# EAGLE board smartstand-usb-dac-amplifier-rev-a (EAGLE 7.3.0), part 1 of 2
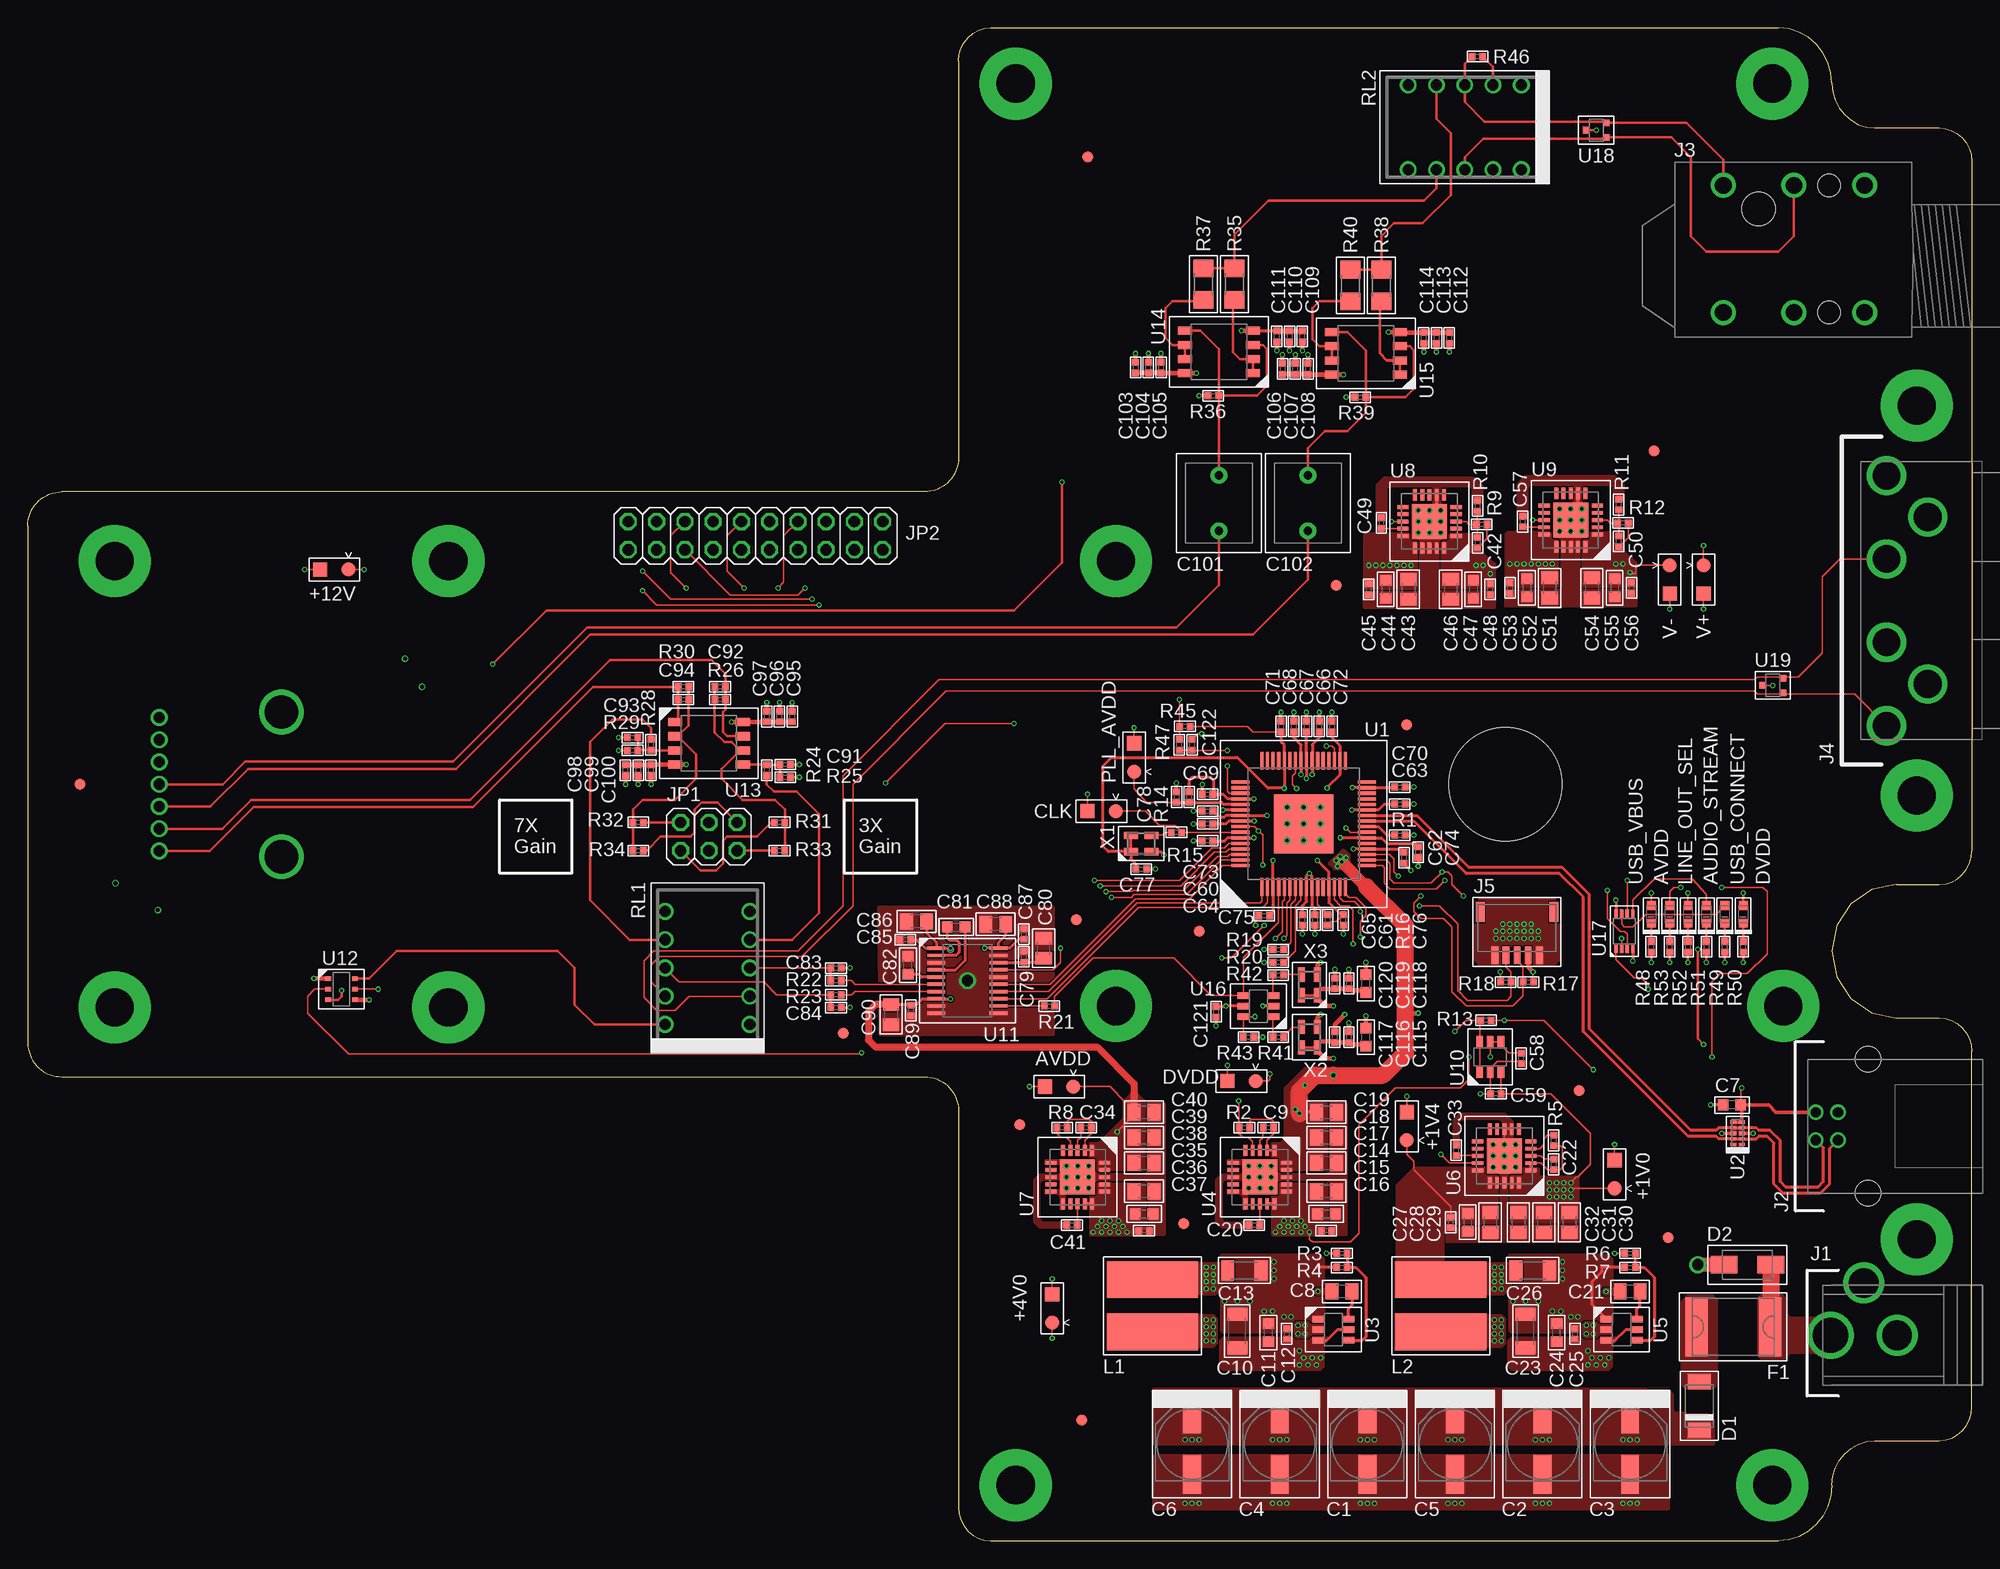
[diagram p13: board, top side]
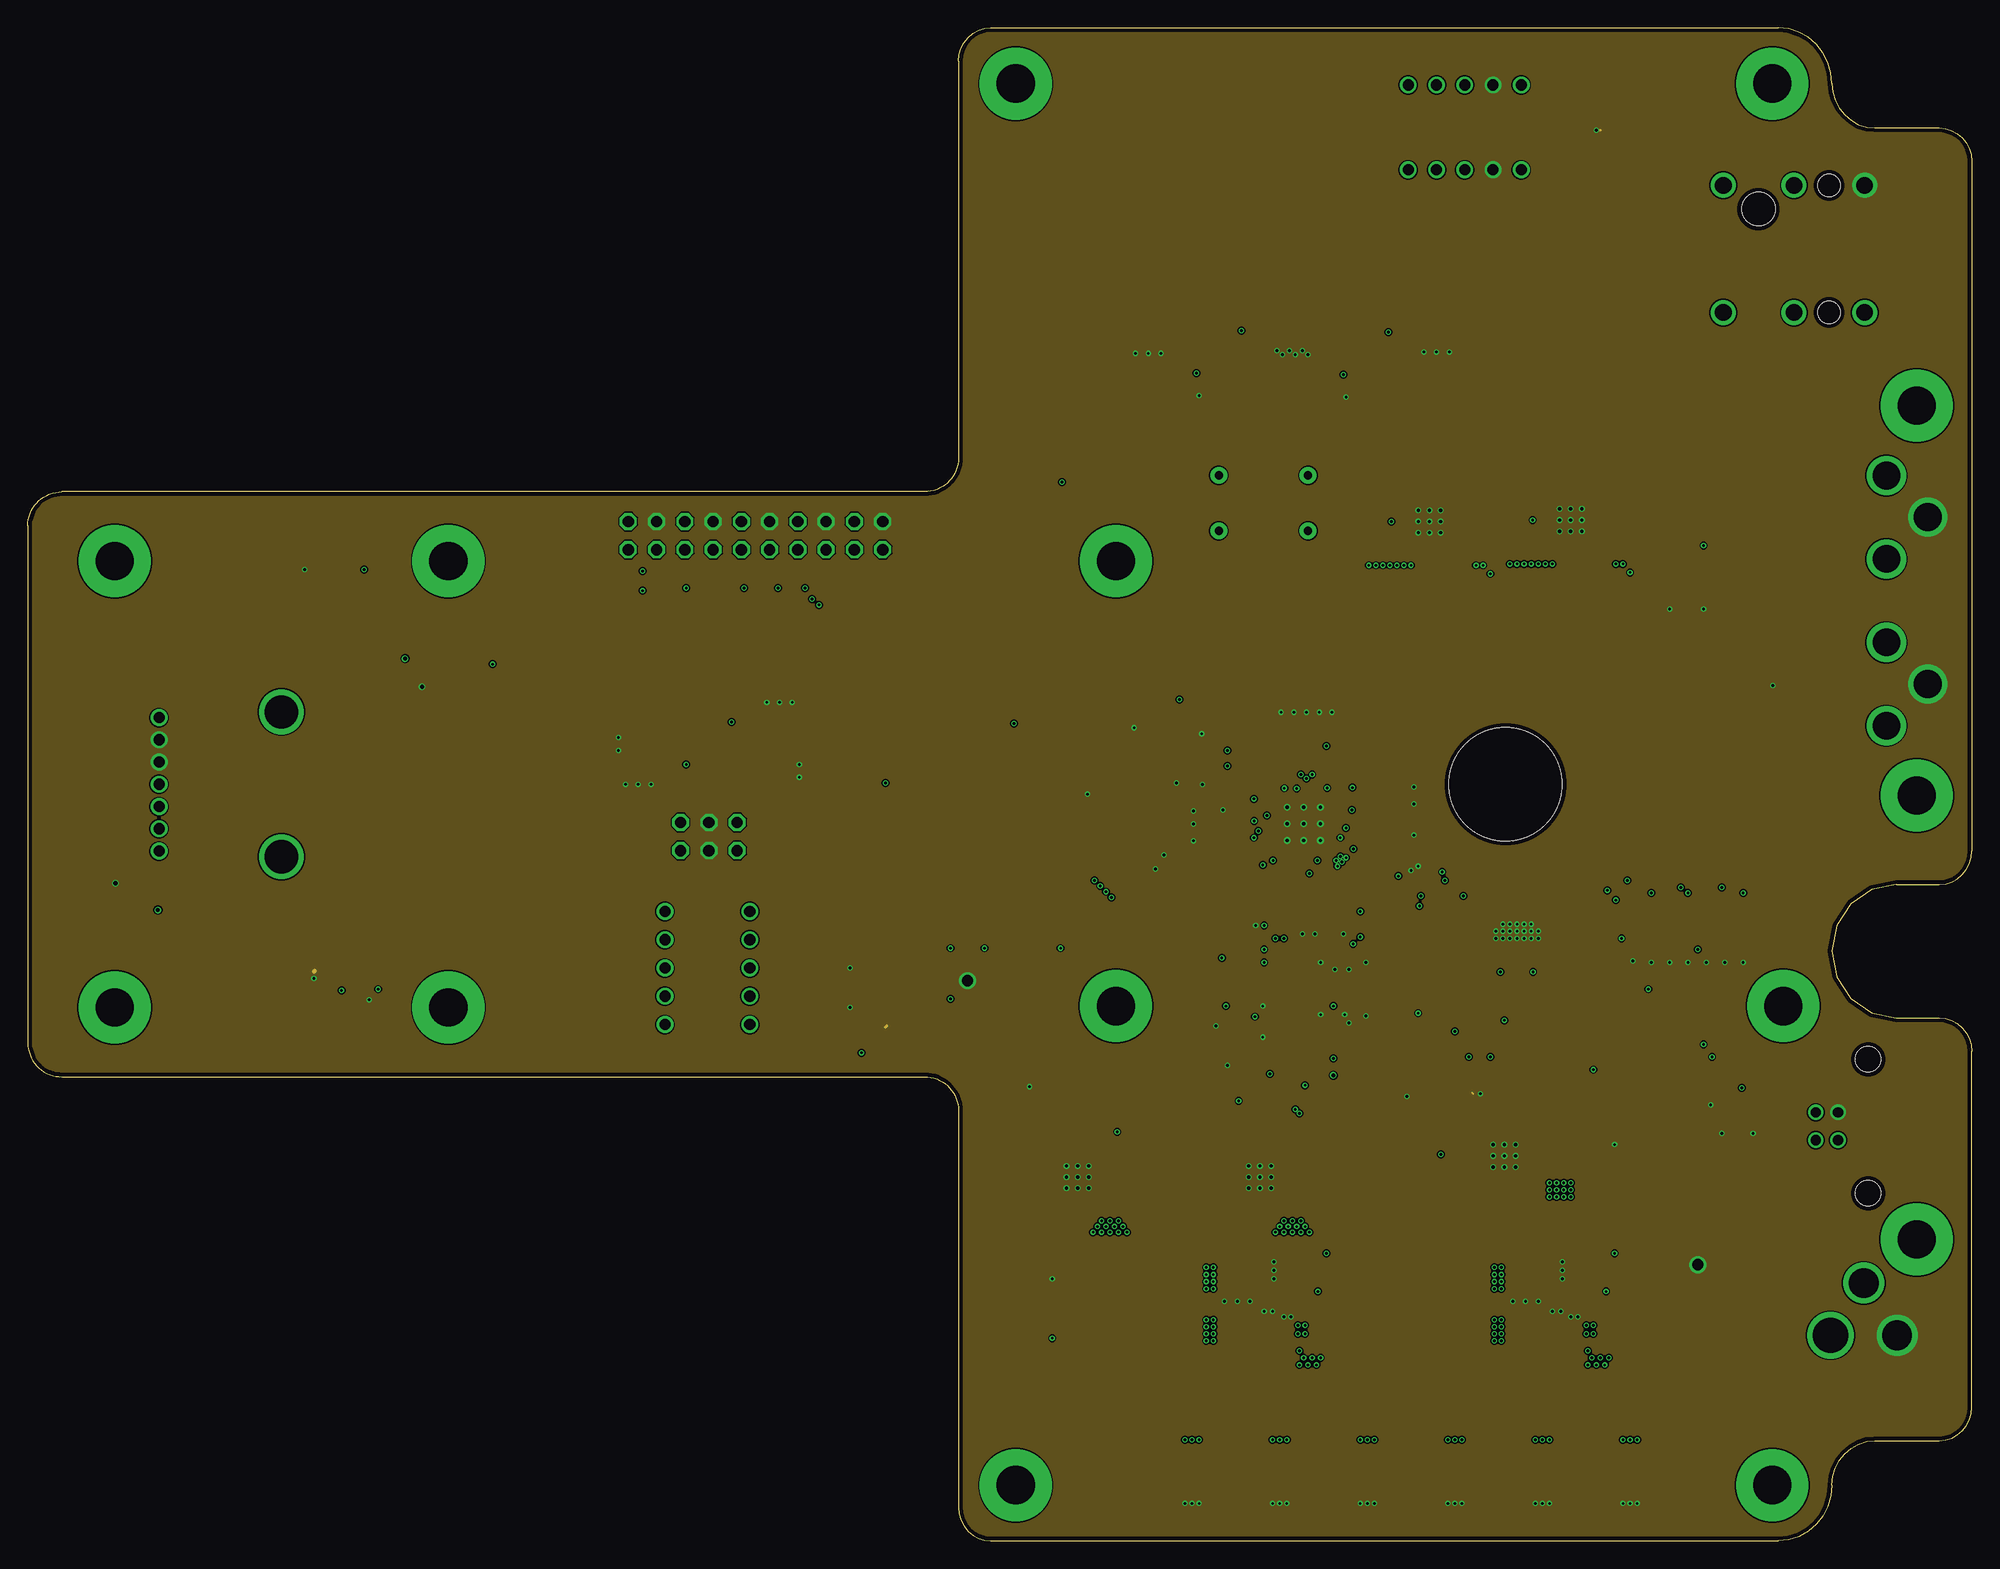
[diagram p14: board, inner layer Route2]
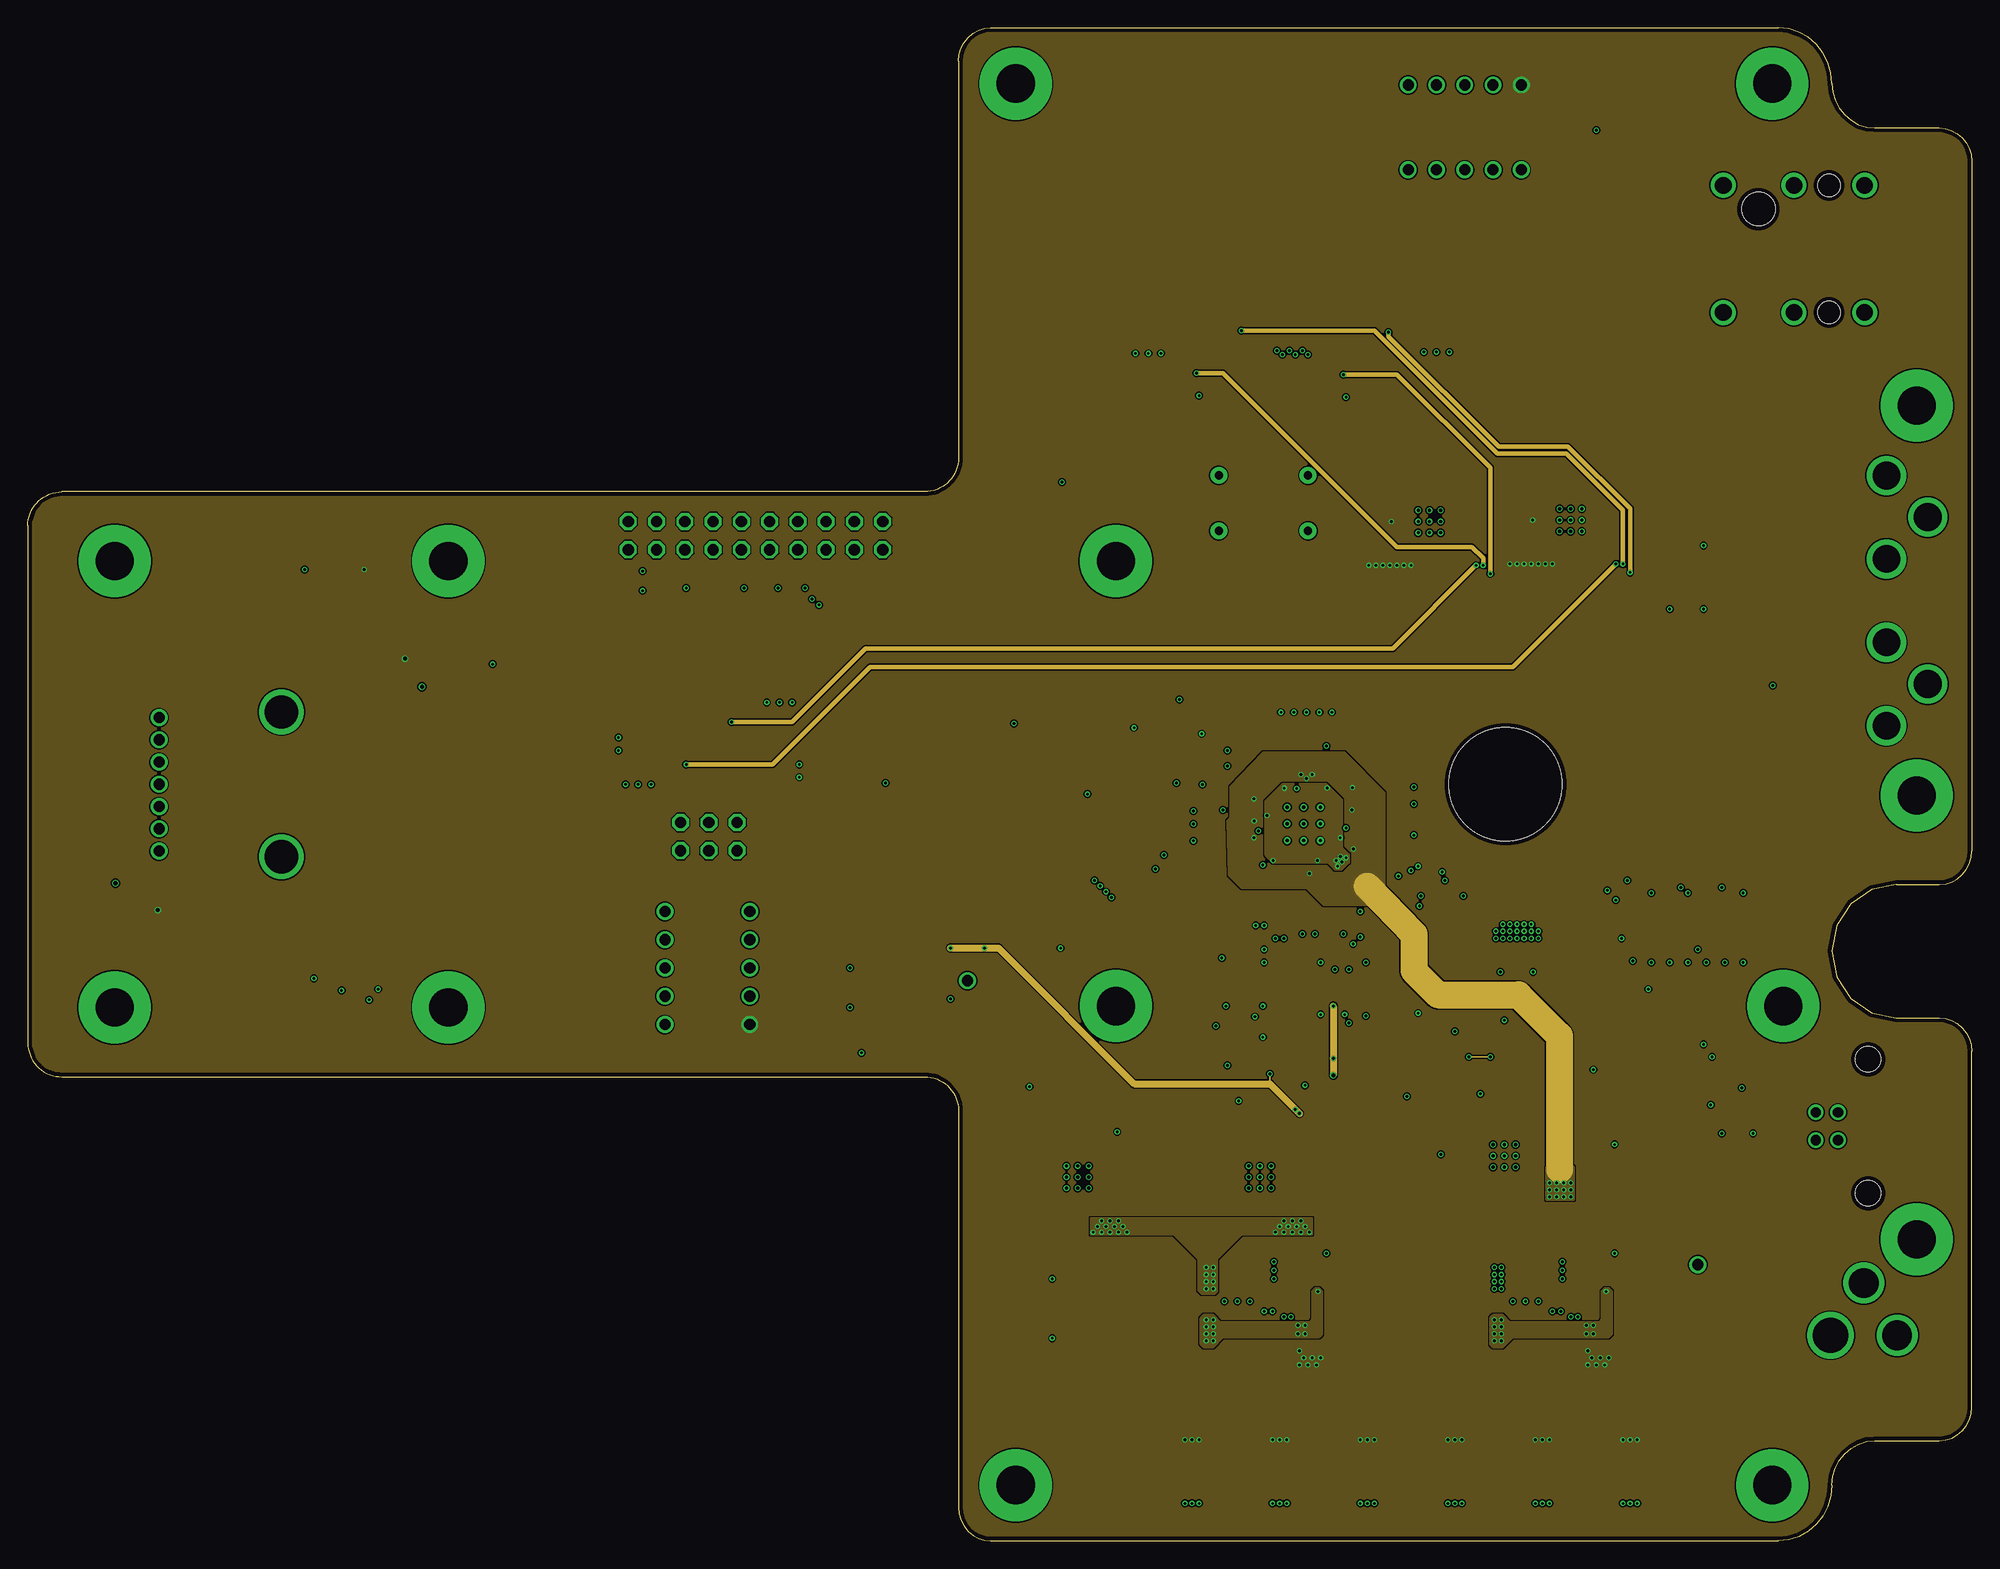
[diagram p15: board, inner layer Route15]
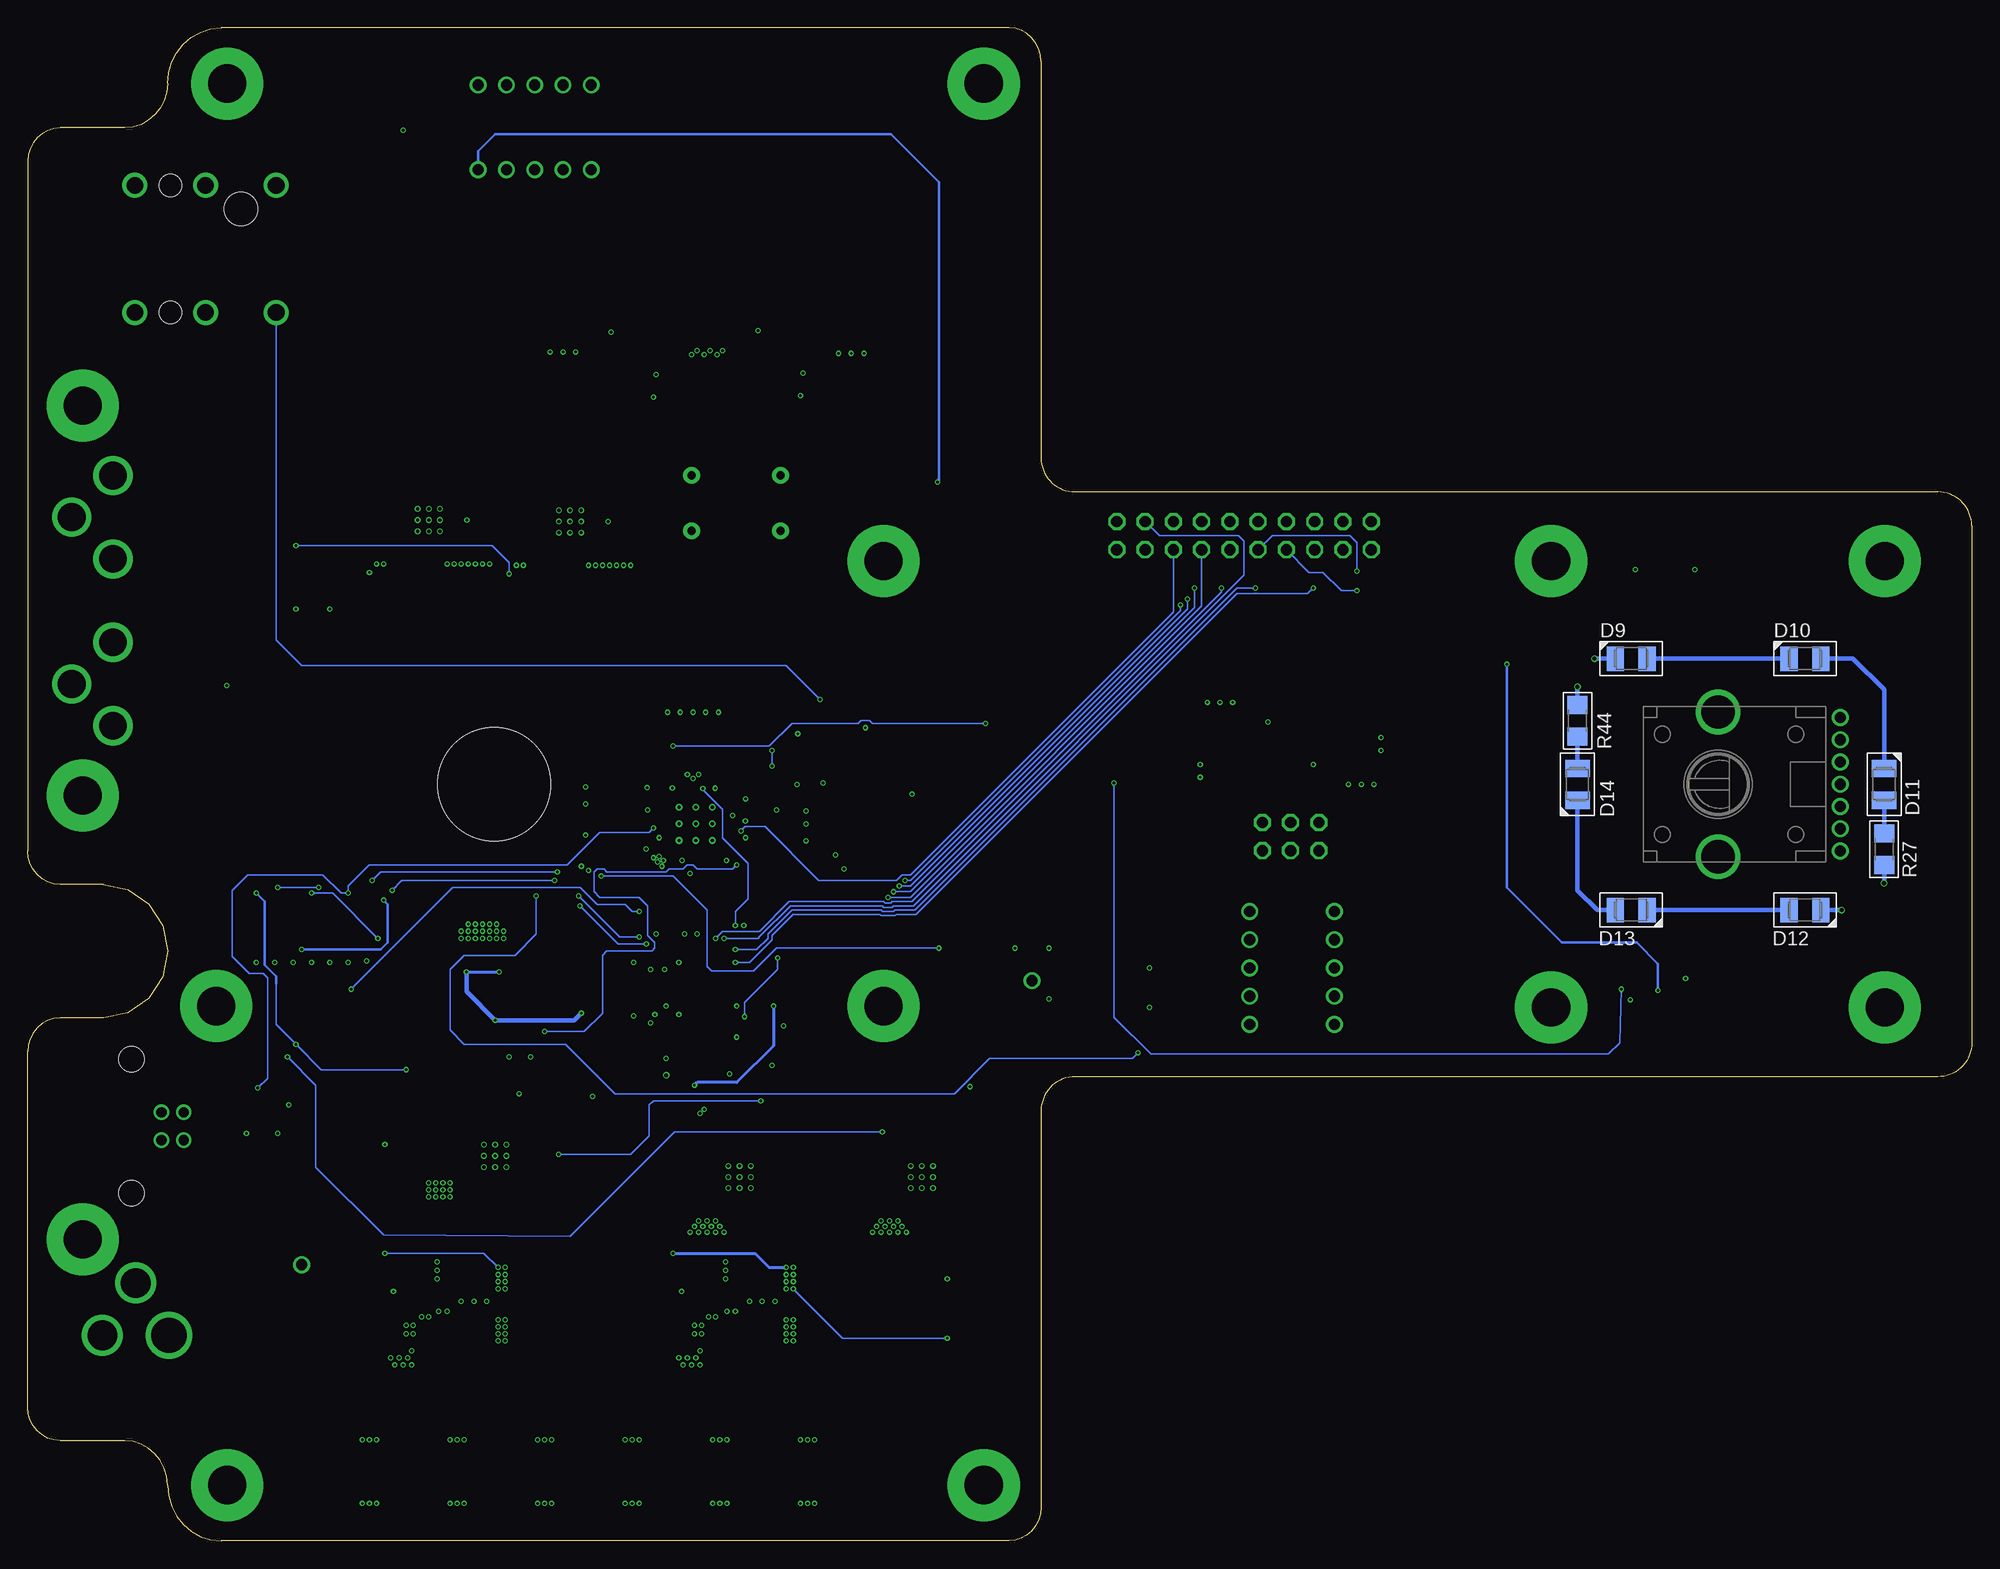
[diagram p16: board, bottom side, seen from below]

Size 174.72 x 136 mm. Coordinates in mm from the lower left corner, seen from the top.
Outline: 171.82,9 172.39,9.06 172.93,9.23 173.43,9.51 173.87,9.88 174.23,10.33 174.5,10.85 174.66,11.41 174.72,12 174.72,44 174.66,44.59 174.5,45.15 174.23,45.67 173.87,46.12 173.43,46.49 172.93,46.77 172.39,46.94 171.82,47 167.96,47 165.74,47.46 163.86,48.76 162.6,50.7 162.16,53 162.6,55.3 163.86,57.24 165.74,58.54 167.96,59 171.82,59 172.39,59.06 172.93,59.23 173.43,59.51 173.87,59.88 174.23,60.33 174.5,60.85 174.66,61.41 174.72,62 174.72,124 174.66,124.59 174.5,125.15 174.23,125.67 173.87,126.12 173.43,126.49 172.93,126.77 172.39,126.94 171.82,127 166.03,127 165.27,127.08 164.55,127.3 163.88,127.67 163.3,128.17 162.81,128.78 162.46,129.47 162.24,130.22 162.16,131 162.07,131.97 161.8,132.91 161.35,133.78 160.75,134.54 160.02,135.16 159.18,135.62 158.28,135.9 157.33,136 86.54,136 85.98,135.94 85.44,135.77 84.93,135.49 84.49,135.12 84.13,134.67 83.87,134.15 83.7,133.58 83.65,133 83.65,97.34 arc-90 80.6,94.29 3.05,94.29 arc90 0,91.24 0,44.76 arc90 3.05,41.71 80.6,41.71 arc-90 83.65,38.66 83.65,3 83.7,2.42 83.87,1.85 84.13,1.33 84.49,0.88 84.93,0.51 85.44,0.23 85.98,0.06 86.54,0 157.33,0 158.28,0.1 159.18,0.38 160.02,0.84 160.75,1.46 161.35,2.22 161.8,3.09 162.07,4.02 162.16,5 162.24,5.78 162.46,6.53 162.81,7.22 163.3,7.83 163.88,8.33 164.55,8.7 165.27,8.92 166.03,9 171.82,9
Copper layers (1*2*15*16): Top 0.035559375mm / dielectric 0.17018125mm / Route2 0.01778125mm / dielectric 47mil / Route15 0.01778125mm / dielectric 0.17018125mm / Bottom 0.035559375mm
Design rules "OSHPark-4Layer": minimum track width 5mil, minimum drill 10mil, track to track 5mil, track to pad 5mil, pad to pad 5mil, via to via 5mil, smd to smd 5mil, copper to edge 15mil, drill to drill 6mil, minimum pad ring 4mil, minimum via ring 4mil, stop-mask expansion 2.5mil, vias tented up to drill 11mil, thermal gap 10mil
Net classes: 0 default: width 0.152 mm, drill 0.254 mm; 1 USB: width 0.279 mm, drill 0.254 mm
Holes 10.16 mm at 132.81,68

## Footprints (pad centres in the part's own frame; a part is rotated, then mirrored left to right if it is on the bottom)
CHEMICON_F55 = smd 3.5 x 1.6: + -2.7,0; - 2.7,0
C0603 = smd 0.95 x 1: 1 -0.8,0; 2 0.8,0
C0805 = smd 1.15 x 1.45: 1 -0.9,0; 2 0.9,0
C0402 = smd 0.59 x 0.64: 1 -0.48,0; 2 0.48,0
C1206 = smd 1.15 x 1.8: 1 -1.5,0; 2 1.5,0
KEMET-5MM-6.0-7.2 = drill 0.75 pad 1.5: P$1 -2.5,0; P$2 2.5,0
SOD128 = smd 1.4 x 2.1: A 2.2,0; C -2.2,0
SMA = smd 2.4 x 1.55: A 2.1,0; C -2.1,0
DIALIGHT-0603 = smd 0.8 x 0.8: 1 -0.8,0; 2 0.8,0
PLCC-2 = smd 1.55 x 2.2: ANODE -1.425,0; CATHODE 1.425,0
2920L = smd 2 x 5.3: P$1 -3.3,0; P$2 3.3,0
PJ-002A = drill 3.175: 1 -3,0 | drill 2.667: 2 3,0; 3 0,4.7
292304 = drill 0.92: P$1 1.25,9.6; P$2 -1.25,9.6; P$3 -1.25,7.6; P$4 1.25,7.6 | hole 2.3: -6.02,4.89; 6.02,4.89
NRJ6HH = drill 1.5: R 0,7.23; RN 0,-4.2; S 6.35,7.23; SN 6.35,-4.2; T -6.35,7.23; TN -6.35,-4.2 | hole 2: 3.15,7.23; 3.15,-4.2 | hole 3: -3.2,5.1
PJRAN2X1U = drill 2.5: L_SHUNT 11.25,3.7; L_SLEEVE 7.5,0; L_TIP 3.75,3.7; R_SHUNT -3.75,3.7; R_SLEEVE -7.5,0; R_TIP -11.25,3.7
T1M-SINGLE-5POS = smd 0.6 x 1.55: 1 2,-2.781; 2 1,-2.781; 3 0,-2.781; 4 -1,-2.781; 5 -2,-2.781 | smd 0.8 x 1.8: G1 3.3,1.094; G2 -3.3,1.094
2X03 = drill 1.016 octagon: 1 -2.54,-1.27; 2 -2.54,1.27; 3 0,-1.27; 4 0,1.27; 5 2.54,-1.27; 6 2.54,1.27
2X10 = drill 1.016 octagon: 1 -11.43,-1.27; 2 -11.43,1.27; 3 -8.89,-1.27; 4 -8.89,1.27; 5 -6.35,-1.27; 6 -6.35,1.27; 7 -3.81,-1.27; 8 -3.81,1.27; 9 -1.27,-1.27; 10 -1.27,1.27; 11 1.27,-1.27; 12 1.27,1.27; 13 3.81,-1.27; 14 3.81,1.27; 15 6.35,-1.27; 16 6.35,1.27; 17 8.89,-1.27; 18 8.89,1.27; 19 11.43,-1.27; 20 11.43,1.27
TDK-VLP8040 = smd 3.3 x 8.2: P$1 -2.35,0; P$2 2.35,0
R0402 = smd 0.59 x 0.64: 1 -0.48,0; 2 0.48,0
R1206 = smd 1.6 x 1.803: 1 -1.422,0; 2 1.422,0
TQ2 = drill 1: P$1 -5.08,-3.81; P$2 -2.54,-3.81; P$3 0,-3.81; P$4 2.54,-3.81; P$5 5.08,-3.81; P$6 5.08,3.81; P$7 2.54,3.81; P$8 0,3.81; P$9 -2.54,3.81; P$10 -5.08,3.81
TESTPOINT-1.5-WITH-GND = smd 1.27 x 1.27: G 1.27,0; S -1.27,0
TQFP-64-EXPOSED-PAD = smd 0.28 x 1.6: P$1 -3.75,-5.68; P$2 -3.25,-5.68; P$3 -2.75,-5.68; P$4 -2.25,-5.68; P$5 -1.75,-5.68; P$6 -1.25,-5.68; P$7 -0.75,-5.68; P$8 -0.25,-5.68; P$9 0.25,-5.68; P$10 0.75,-5.68; P$11 1.25,-5.68; P$12 1.75,-5.68; P$13 2.25,-5.68; P$14 2.75,-5.68; P$15 3.25,-5.68; P$16 3.75,-5.68; P$33 3.75,5.68; P$34 3.25,5.68; P$35 2.75,5.68; P$36 2.25,5.68; P$37 1.75,5.68; P$38 1.25,5.68; P$39 0.75,5.68; P$40 0.25,5.68; P$41 -0.25,5.68; P$42 -0.75,5.68; P$43 -1.25,5.68; P$44 -1.75,5.68; P$45 -2.25,5.68; P$46 -2.75,5.68; P$47 -3.25,5.68; P$48 -3.75,5.68 | smd 1.6 x 0.28: P$17 5.68,-3.75; P$18 5.68,-3.25; P$19 5.68,-2.75; P$20 5.68,-2.25; P$21 5.68,-1.75; P$22 5.68,-1.25; P$23 5.68,-0.75; P$24 5.68,-0.25; P$25 5.68,0.25; P$26 5.68,0.75; P$27 5.68,1.25; P$28 5.68,1.75; P$29 5.68,2.25; P$30 5.68,2.75; P$31 5.68,3.25; P$32 5.68,3.75; P$49 -5.68,3.75; P$50 -5.68,3.25; P$51 -5.68,2.75; P$52 -5.68,2.25; P$53 -5.68,1.75; P$54 -5.68,1.25; P$55 -5.68,0.75; P$56 -5.68,0.25; P$57 -5.68,-0.25; P$58 -5.68,-0.75; P$59 -5.68,-1.25; P$60 -5.68,-1.75; P$61 -5.68,-2.25; P$62 -5.68,-2.75; P$63 -5.68,-3.25; P$64 -5.68,-3.75 | smd 5.31 x 5.31: P$65 0,0 | drill 0.3 pad 0.6: P$66 -1.5,1.5; P$67 0,1.5; P$68 1.5,1.5; P$69 -1.5,0; P$70 0,0; P$71 1.5,0; P$72 -1.5,-1.5; P$73 0,-1.5; P$74 1.5,-1.5
R-PUSON-N10 = smd 0.3 x 0.55: P$1 -1,-0.385; P$2 -0.5,-0.385; P$4 0.5,-0.385; P$5 1,-0.385; P$6 1,0.385; P$7 0.5,0.385; P$9 -0.5,0.385; P$10 -1,0.385 | smd 0.4 x 0.55: P$3 0,-0.385; P$8 0,0.385
R-PDSO-G6-DBV = smd 0.6 x 1.1: 1 -0.95,-1.35; 2 0,-1.35; 3 0.95,-1.35; 4 0.95,1.35; 5 0,1.35; 6 -0.95,1.35
S-PVQFN-N20 = smd 0.35 x 1: P$1 -1.3,-2.4; P$2 -0.65,-2.4; P$3 0,-2.4; P$4 0.65,-2.4; P$5 1.3,-2.4; P$11 1.3,2.4; P$12 0.65,2.4; P$13 0,2.4; P$14 -0.65,2.4; P$15 -1.3,2.4 | smd 1 x 0.35: P$6 2.4,-1.3; P$7 2.4,-0.65; P$8 2.4,0; P$9 2.4,0.65; P$10 2.4,1.3; P$16 -2.4,1.3; P$17 -2.4,0.65; P$18 -2.4,0; P$19 -2.4,-0.65; P$20 -2.4,-1.3 | drill 0.3 pad 0.406: P$21 0,0; P$22 -1,0; P$23 1,0; P$24 1,1; P$25 0,1; P$26 -1,1; P$27 -1,-1; P$28 0,-1; P$29 1,-1 | smd 3.15 x 3.15: P$EP 0,0
R-PDSO-G20 = smd 0.3 x 1.6: P$1 -2.925,-2.8; P$2 -2.275,-2.8; P$3 -1.625,-2.8; P$4 -0.975,-2.8; P$5 -0.325,-2.8; P$6 0.325,-2.8; P$7 0.975,-2.8; P$8 1.625,-2.8; P$9 2.275,-2.8; P$10 2.925,-2.8; P$11 2.925,2.8; P$12 2.275,2.8; P$13 1.625,2.8; P$14 0.975,2.8; P$15 0.325,2.8; P$16 -0.325,2.8; P$17 -0.975,2.8; P$18 -1.625,2.8; P$19 -2.275,2.8; P$20 -2.925,2.8
SOT-457 = smd 0.5 x 0.4: 1 -1.2,0.95; 2 -1.2,0; 3 -1.2,-0.95; 4 1.2,-0.95; 5 1.2,0; 6 1.2,0.95
DMP8 = smd 0.72 x 1.27: P$1 -1.905,-3.05; P$2 -0.635,-3.05; P$3 0.635,-3.05; P$4 1.905,-3.05; P$5 1.905,3.05; P$6 0.635,3.05; P$7 -0.635,3.05; P$8 -1.905,3.05
R-PDSO-G8-DCU = smd 0.3 x 0.8: 1 -0.75,-1.55; 2 -0.25,-1.55; 3 0.25,-1.55; 4 0.75,-1.55; 5 0.75,1.55; 6 0.25,1.55; 7 -0.25,1.55; 8 -0.75,1.55
R-PDSO-G3 = smd 0.6 x 0.55: 1 0.65,0.925; 2 -0.65,0.925; 3 0,-0.925
FIDUCIAL_1MM = smd 1 x 1: 1 0,0
RK14K = drill 1: DUMMY 6,-11; L1 -6,-11; L2 0,-11; L3 4,-11; R1 -4,-11; R2 -2,-11; R3 2,-11 | drill 3: MECH1 -6.5,0; MECH2 6.5,0
KC2520C = smd 1.27 x 0.635: P$1 -0.925,-0.725; P$2 0.925,-0.725; P$3 0.925,0.725; P$4 -0.925,0.725

## Placement (x,y rotation side)
C1  47uF  [CHEMICON_F55]  120.4,8.69 270 top
C2  47uF  [CHEMICON_F55]  136.14,8.69 270 top
C3  47uF  [CHEMICON_F55]  144.02,8.69 270 top
C4  47uF  [CHEMICON_F55]  112.52,8.69 270 top
C5  47uF  [CHEMICON_F55]  128.27,8.69 270 top
C6  47uF  [CHEMICON_F55]  104.65,8.69 270 top
C7  1uF  [C0603]  153.16,39.17 180 top
C8  100nF  [C0805]  118.11,22.41 180 top
C9  10nF  [C0402]  111.51,37.14 180 top
C10  22uF  [C1206]  108.71,18.85 90 top
C11  1uF  [C0603]  111.51,18.72 90 top
C12  100nF  [C0402]  113.16,18.6 90 top
C13  47uF  [C1206]  109.35,24.31 0 top
C14  10uF  [C0805]  116.71,31.42 0 top
C15  1uF  [C0603]  116.71,29.39 0 top
C16  100nF  [C0402]  116.71,27.87 0 top
C17  10uF  [C0805]  116.71,33.96 0 top
C18  10uF  [C0805]  116.71,36.25 0 top
C19  10uF  [C0805]  116.71,38.54 0 top
C20  10nF  [C0402]  110.24,28.38 180 top
C21  100nF  [C0805]  144.02,22.41 180 top
C22  10nF  [C0402]  137.16,33.84 90 top
C23  22uF  [C1206]  134.62,18.85 90 top
C24  1uF  [C0603]  137.41,18.72 90 top
C25  100nF  [C0402]  139.06,18.6 90 top
C26  47uF  [C1206]  135.25,24.31 0 top
C27  10uF  [C0805]  131.44,28.63 270 top
C28  1uF  [C0603]  129.41,28.63 270 top
C29  100nF  [C0402]  127.89,28.63 270 top
C30  10uF  [C0805]  138.56,28.63 270 top
C31  10uF  [C0805]  136.27,28.63 270 top
C32  10uF  [C0805]  133.99,28.63 270 top
C33  10nF  [C0402]  128.4,35.11 90 top
C34  10nF  [C0402]  95.12,37.14 180 top
C35  10uF  [C0805]  100.33,31.42 0 top
C36  1uF  [C0603]  100.33,29.39 0 top
C37  100nF  [C0402]  100.33,27.87 0 top
C38  10uF  [C0805]  100.33,33.96 0 top
C39  10uF  [C0805]  100.33,36.25 0 top
C40  10uF  [C0805]  100.33,38.54 0 top
C41  10nF  [C0402]  93.85,28.38 180 top
C42  100nF  [C0402]  130.3,89.72 90 top
C43  10uF  [C0805]  124.08,85.53 270 top
C44  1uF  [C0603]  122.05,85.53 270 top
C45  100nF  [C0402]  120.52,85.53 270 top
C46  10uF  [C0805]  127.89,85.53 270 top
C47  1uF  [C0603]  129.92,85.53 270 top
C48  100nF  [C0402]  131.44,85.53 270 top
C49  100nF  [C0402]  121.67,91.5 90 top
C50  100nF  [C0402]  143,89.84 90 top
C51  10uF  [C0805]  136.78,85.65 270 top
C52  1uF  [C0603]  134.75,85.65 270 top
C53  100nF  [C0402]  133.22,85.65 270 top
C54  10uF  [C0805]  140.59,85.65 270 top
C55  1uF  [C0603]  142.62,85.65 270 top
C56  100nF  [C0402]  144.14,85.65 270 top
C57  100nF  [C0402]  134.37,91.62 90 top
C58  10nF  [C0402]  134.24,43.36 90 top
C59  10nF  [C0402]  131.95,40.19 0 top
C60  100nF  [C0402]  106.04,64.44 180 top
C61  100nF  [C0402]  115.7,55.81 270 top
C62  100nF  [C0402]  123.7,61.4 270 top
C63  100nF  [C0402]  123.32,66.22 0 top
C64  100nF  [C0402]  106.04,62.92 180 top
C65  100nF  [C0402]  114.55,55.81 270 top
C66  100nF  [C0402]  116.08,73.21 90 top
C67  100nF  [C0402]  114.94,73.21 90 top
C68  100nF  [C0402]  113.79,73.21 90 top
C69  100nF  [C0402]  106.04,67.11 180 top
C70  100nF  [C0402]  123.32,67.75 0 top
C71  100nF  [C0402]  112.65,73.21 90 top
C72  100nF  [C0402]  117.22,73.21 90 top
C73  100nF  [C0402]  106.04,65.59 180 top
C74  100nF  [C0402]  124.97,61.9 270 top
C75  100nF  [C0402]  111.12,56.19 180 top
C76  100nF  [C0402]  118.24,55.81 270 top
C77  100nF  [C0402]  100.08,60.38 180 top
C78  100nF  [C0402]  103.25,66.86 90 top
C79  100nF  [C0402]  89.53,52.51 90 top
C80  10uF  [C0805]  91.31,53.27 90 top
C81  2.2uF  [C0603]  83.44,55.17 0 top
C82  2.2uF  [C0603]  79.12,51.74 90 top
C83  2.2nF, C0G  [C0402]  72.64,51.49 0 top
C84  2.2nF, C0G  [C0402]  72.64,47.93 0 top
C85  100nF  [C0402]  78.87,54.03 180 top
C86  10uF  [C0805]  79.88,55.68 180 top
C87  100nF  [C0402]  89.53,54.54 90 top
C88  10uF  [C0805]  86.99,55.43 180 top
C89  100nF  [C0402]  79.38,47.68 270 top
C90  10uF  [C0805]  77.6,47.3 270 top
C91  220pF, C0G  [C0402]  68.07,69.78 0 top
C92  220pF, C0G  [C0402]  62.23,76.76 0 top
C93  220pF, C0G  [C0402]  54.36,72.19 180 top
C94  220pF, C0G  [C0402]  58.93,75.62 180 top
C95  100nF  [C0402]  68.71,74.1 90 top
C96  10nF  [C0402]  67.56,74.1 90 top
C97  33pF  [C0402]  66.42,74.1 90 top
C98  100nF  [C0402]  53.72,69.27 270 top
C99  10nF  [C0402]  54.86,69.27 270 top
C100  33pF  [C0402]  56.01,69.27 270 top
C101  2.2uF  [KEMET-5MM-6.0-7.2]  107.06,93.27 90 top
C102  2.2uF  [KEMET-5MM-6.0-7.2]  115.06,93.27 90 top
C103  100nF  [C0402]  99.57,105.47 90 top
C104  10nF  [C0402]  100.71,105.47 90 top
C105  33pF  [C0402]  101.85,105.47 90 top
C106  100nF  [C0402]  112.78,105.34 90 top
C107  10nF  [C0402]  113.92,105.34 90 top
C108  33pF  [C0402]  115.06,105.34 90 top
C109  100nF  [C0402]  114.55,108.26 270 top
C110  10nF  [C0402]  113.41,108.26 270 top
C111  33pF  [C0402]  112.27,108.26 270 top
C112  100nF  [C0402]  127.76,108.13 270 top
C113  10nF  [C0402]  126.62,108.13 270 top
C114  33pF  [C0402]  125.48,108.13 270 top
C115  1uF  [C0603]  120.27,45.27 90 top
C116  100nF  [C0402]  118.75,45.27 90 top
C117  10nF  [C0402]  117.47,45.27 90 top
C118  1uF  [C0603]  120.27,50.09 90 top
C119  100nF  [C0402]  118.75,50.09 90 top
C120  10nF  [C0402]  117.47,50.09 90 top
C121  100nF  [C0402]  106.81,47.55 270 top
C122  100nF  [C0402]  104.65,71.56 90 top
D1  5A  [SOD128]  150.24,12.12 90 top
D2  13.6V  [SMA]  154.56,24.82 180 top
D3  1.8V, 10mA  [DIALIGHT-0603]  145.92,56.32 270 top
D4  1.8V, 10mA  [DIALIGHT-0603]  152.53,56.32 270 top
D5  1.8V, 10mA  [DIALIGHT-0603]  154.18,56.32 270 top
D6  1.8V, 10mA  [DIALIGHT-0603]  150.88,56.32 270 top
D7  1.8V, 10mA  [DIALIGHT-0603]  149.22,56.32 270 top
D8  1.8V, 10mA  [DIALIGHT-0603]  147.57,56.32 270 top
D9  CLM3C  [PLCC-2]  30.61,79.3 0 bottom
D10  CLM3C  [PLCC-2]  14.99,79.3 0 bottom
D11  CLM3C  [PLCC-2]  7.87,68 270 bottom
D12  CLM3C  [PLCC-2]  14.99,56.7 180 bottom
D13  CLM3C  [PLCC-2]  30.61,56.7 180 bottom
D14  CLM3C  [PLCC-2]  35.43,68 90 bottom
F1  0.6A  [2920L]  153.29,19.23 180 top
J1  PJ-002A  [PJ-002A]  165.02,18.47 0 top
J2  292304-1  [292304]  170.31,37.27 90 top
J3  NRJ6HH  [NRJ6HH]  158.75,114.61 0 top
J4  PJRAN2X1U01AUX  [PJRAN2X1U]  170.76,84.51 90 top
J5  T1M-5POS  [T1M-SINGLE-5POS]  133.86,55.43 0 top
JP1  [2X03]  61.21,63.3 0 top
JP2  [2X10]  65.41,90.35 0 top
L1  2.2uH  [TDK-VLP8040]  101.09,21.14 270 top
L2  1.5uH  [TDK-VLP8040]  127,21.14 270 top
R1  43.2  [R0402]  123.32,63.43 180 top
R2  10K  [R0402]  109.35,37.14 180 top
R3  40.2K  [R0402]  118.11,25.84 180 top
R4  10K  [R0402]  118.11,24.57 0 top
R5  10K  [R0402]  137.16,36 90 top
R6  8.45K  [R0402]  144.02,25.84 180 top
R7  10K  [R0402]  144.02,24.57 0 top
R8  10K  [R0402]  92.96,37.14 180 top
R9  66.5K  [R0402]  130.68,91.37 0 top
R10  9.76K  [R0402]  130.3,93.02 270 top
R11  1.15M  [R0402]  143.38,91.5 0 top
R12  137K  [R0402]  143,93.15 270 top
R13  10K  [R0402]  131.06,46.79 0 top
R14  4.7  [R0402]  104.39,66.86 90 top
R15  0  [R0402]  103.25,63.68 0 top
R16  1K  [R0402]  116.84,55.81 270 top
R17  4.7K  [R0402]  134.87,50.22 0 top
R18  4.7K  [R0402]  132.84,50.22 180 top
R19  33  [R0402]  112.39,53.14 180 top
R20  33  [R0402]  112.39,52 180 top
R21  0  [R0402]  91.82,48.06 0 top
R22  470, 0.1%  [R0402]  72.64,50.35 180 top
R23  470, 0.1%  [R0402]  72.64,49.08 180 top
R24  243, 0.1%  [R0402]  66.42,69.27 90 top
R25  10K, 0.1%  [R0402]  68.07,68.64 180 top
R26  1.5K, 0.1%  [R0402]  62.23,75.62 0 top
R27  150  [R1206]  7.87,62.16 90 bottom
R28  243, 0.1%  [R0402]  56.01,71.56 270 top
R29  10K, 0.1%  [R0402]  54.36,71.05 0 top
R30  1.5K, 0.1%  [R0402]  58.93,76.76 180 top
R31  243, 0.1%  [R0402]  67.56,64.57 180 top
R32  243, 0.1%  [R0402]  54.86,64.57 180 top
R33  715, 0.1%  [R0402]  67.56,62.03 180 top
R34  715, 0.1%  [R0402]  54.86,62.03 180 top
R35  1, 1%  [R1206]  108.46,112.96 90 top
R36  40.2K, 0.1%  [R0402]  106.55,102.92 0 top
R37  1, 1%  [R1206]  105.66,112.96 90 top
R38  1, 1%  [R1206]  121.67,112.83 90 top
R39  40.2K, 0.1%  [R0402]  119.76,102.8 0 top
R40  1, 1%  [R1206]  118.87,112.83 90 top
R41  0  [R0402]  112.39,45.27 0 top
R42  0  [R0402]  112.39,50.86 0 top
R43  100K  [R0402]  109.73,45.27 180 top
R44  150  [R1206]  35.43,73.72 270 bottom
R45  100K  [R0402]  104.01,73.21 0 top
R46  10K, 0.1%  [R0402]  130.3,133.41 180 top
R47  49.9K  [R0402]  103.5,71.56 270 top
R48  330  [R0402]  145.92,53.39 90 top
R49  150  [R0402]  152.53,53.39 90 top
R50  150  [R0402]  154.18,53.39 90 top
R51  150  [R0402]  150.88,53.39 90 top
R52  150  [R0402]  149.22,53.39 90 top
R53  150  [R0402]  147.57,53.39 90 top
RL1  TQ2-12V  [TQ2]  61.09,51.49 90 top
RL2  TQ2-12V  [TQ2]  129.16,127.06 180 top
TP1  TESTPOINT-WITH-GND  [TESTPOINT-1.5-WITH-GND]  96.52,65.59 180 top
TP2  TESTPOINT-WITH-GND  [TESTPOINT-1.5-WITH-GND]  27.56,87.3 180 top
TP3  TESTPOINT-WITH-GND  [TESTPOINT-1.5-WITH-GND]  92.07,20.88 90 top
TP4  TESTPOINT-WITH-GND  [TESTPOINT-1.5-WITH-GND]  99.44,70.41 90 top
TP5  TESTPOINT-WITH-GND  [TESTPOINT-1.5-WITH-GND]  92.71,40.82 180 top
TP6  TESTPOINT-WITH-GND  [TESTPOINT-1.5-WITH-GND]  109.09,41.33 180 top
TP7  TESTPOINT-WITH-GND  [TESTPOINT-1.5-WITH-GND]  123.95,37.27 90 top
TP8  TESTPOINT-WITH-GND  [TESTPOINT-1.5-WITH-GND]  142.62,32.95 90 top
TP9  TESTPOINT-WITH-GND  [TESTPOINT-1.5-WITH-GND]  150.62,86.41 270 top
TP10  TESTPOINT-WITH-GND  [TESTPOINT-1.5-WITH-GND]  147.57,86.41 270 top
U1  XUF208-256-TQ64  [TQFP-64-EXPOSED-PAD]  114.68,64.44 0 top
U2  TPD4E02B04DQA  [R-PUSON-N10]  153.67,36.63 90 top
U3  TPS563200DDC  [R-PDSO-G6-DBV]  117.35,18.98 270 top
U4  TPS7A8300RGW  [S-PVQFN-N20]  110.74,32.69 180 top
U5  TPS563200DDC  [R-PDSO-G6-DBV]  143.26,18.98 270 top
U6  TPS7A8300RGW  [S-PVQFN-N20]  132.72,34.6 90 top
U7  TPS7A8300RGW  [S-PVQFN-N20]  94.36,32.69 180 top
U8  TPS7A4701RGW  [S-PVQFN-N20]  125.98,91.62 90 top
U9  TPS7A3301RGW  [S-PVQFN-N20]  138.68,91.75 90 top
U10  TPS3702  [R-PDSO-G6-DBV]  131.44,43.49 0 top
U11  PCM5102A  [R-PDSO-G20]  84.45,50.35 270 top
U12  SZNUD3124  [SOT-457]  28.19,49.59 0 top
U13  NJM2068M  [DMP8]  61.21,71.68 270 top
U14  NJM4556AM  [DMP8]  107.06,106.86 90 top
U15  NJM4556AM  [DMP8]  120.27,106.73 90 top
U16  TS5A3159DBV  [R-PDSO-G6-DBV]  110.62,48.06 90 top
U17  SN74LVC3G34DCU  [R-PDSO-G8-DCU]  143.51,54.79 0 top
U18  TPD2E007DCK  [R-PDSO-G3]  140.97,126.8 270 top
U19  TPD2E007DCK  [R-PDSO-G3]  156.84,76.89 270 top
U$1  FIDUCIAL-1MM  [FIDUCIAL_1MM]  4.7,68 0 top
U$2  FIDUCIAL-1MM  [FIDUCIAL_1MM]  105.28,54.79 0 top
U$3  FIDUCIAL-1MM  [FIDUCIAL_1MM]  123.95,73.33 0 top
U$4  FIDUCIAL-1MM  [FIDUCIAL_1MM]  95.25,124.39 0 top
U$5  FIDUCIAL-1MM  [FIDUCIAL_1MM]  94.74,10.85 0 top
U$6  FIDUCIAL-1MM  [FIDUCIAL_1MM]  117.6,85.91 0 top
U$7  FIDUCIAL-1MM  [FIDUCIAL_1MM]  147.45,27.23 0 top
U$8  FIDUCIAL-1MM  [FIDUCIAL_1MM]  146.18,97.97 0 top
U$9  FIDUCIAL-1MM  [FIDUCIAL_1MM]  73.28,45.65 0 top
U$10  FIDUCIAL-1MM  [FIDUCIAL_1MM]  94.23,55.81 0 top
U$11  FIDUCIAL-1MM  [FIDUCIAL_1MM]  103.89,28.5 0 top
U$12  FIDUCIAL-1MM  [FIDUCIAL_1MM]  89.15,37.39 0 top
U$13  FIDUCIAL-1MM  [FIDUCIAL_1MM]  139.45,40.44 0 top
VR1  RK14K  [RK14K]  22.8,68 90 bottom
X1  24MHz  [KC2520C]  100.08,62.67 0 top
X2  22.5792MHz  [KC2520C]  115.19,45.27 90 top
X3  24.576MHz  [KC2520C]  115.19,49.97 90 top